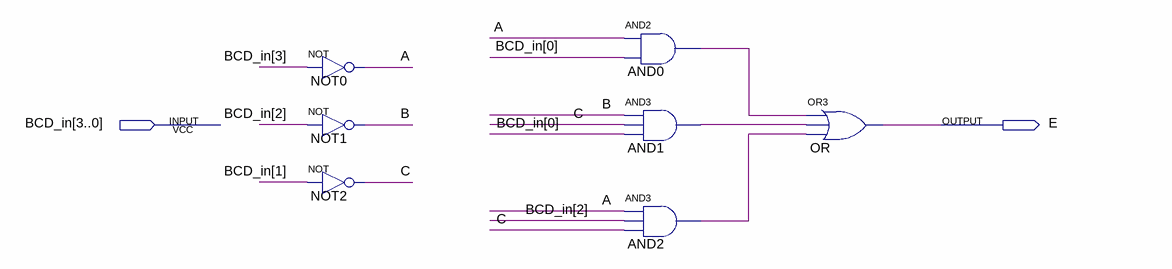
[diagram p0: schematic sheet]
// Quartus schematic DECOD_BCD_E.bdf as structural Verilog: 7 symbols, 2 pins
module DECOD_BCD_E (
  input  [3:0] BCD_in,
  output E
);

  wire A, AND0_out, AND1_out, AND2_out, B, C;

  not NOT0 (A, BCD_in[3]);
  not NOT1 (B, BCD_in[2]);
  not NOT2 (C, BCD_in[1]);
  and AND0 (AND0_out, A, BCD_in[0]);
  and AND1 (AND1_out, B, C, BCD_in[0]);
  and AND2 (AND2_out, A, BCD_in[2], C);
  or OR (E, AND0_out, AND1_out, AND2_out);
endmodule
